# Altium schematic sheet Valve_transistors.SchDoc
size A; SheetNumber: 5; SheetTotal: 6
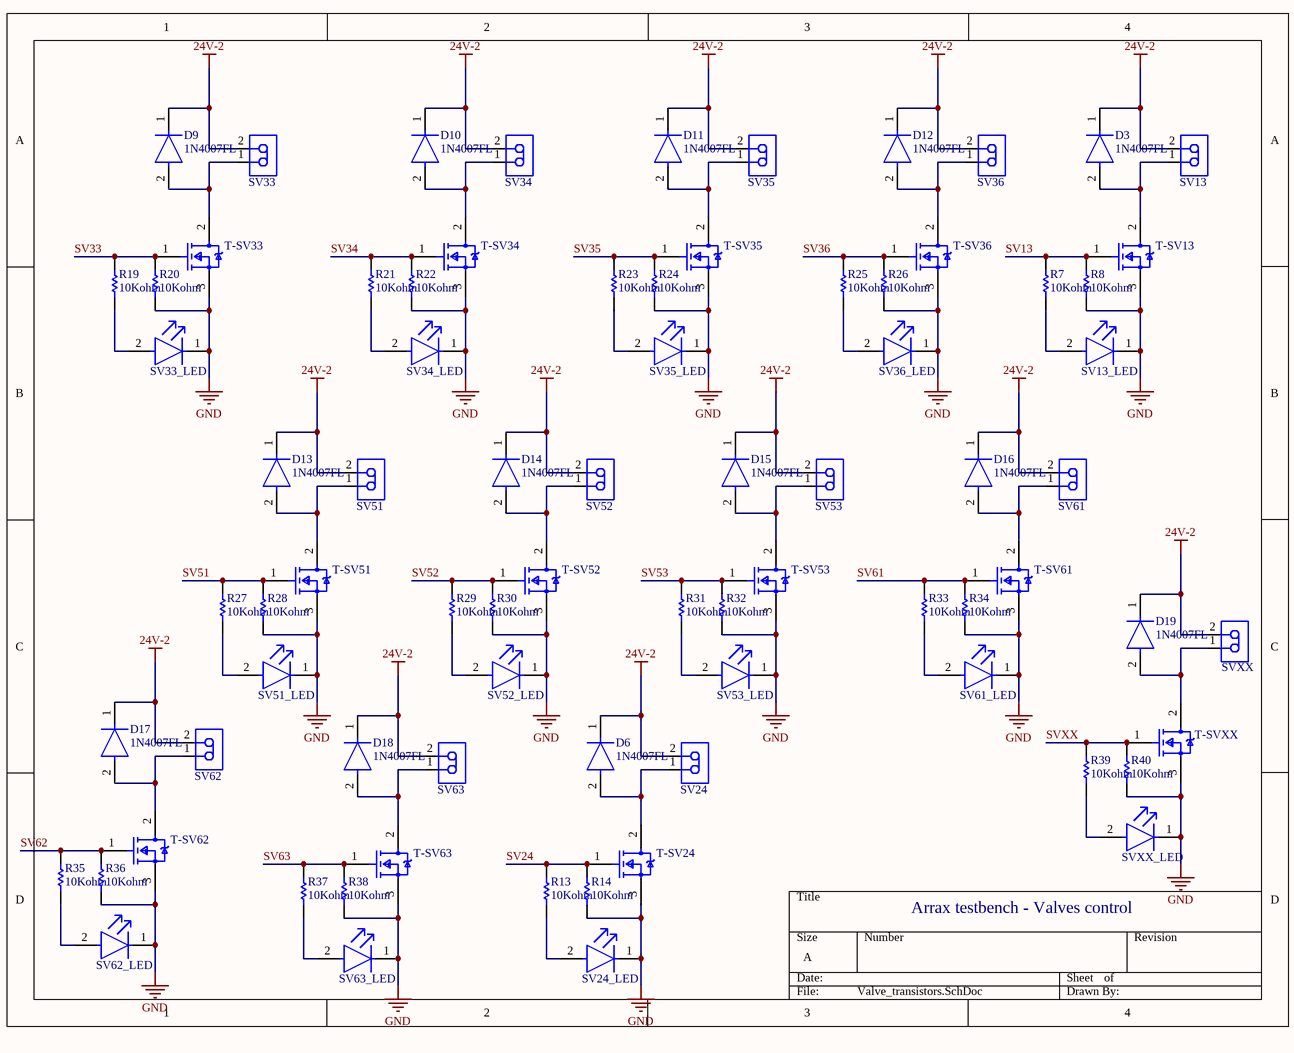
[diagram p0: Valve_transistors.SchDoc]

## Parts
D3  1N4007FL  [FP-1N4007FL-MFG]
D6  1N4007FL  [FP-1N4007FL-MFG]
D9  1N4007FL  [FP-1N4007FL-MFG]
D10  1N4007FL  [FP-1N4007FL-MFG]
D11  1N4007FL  [FP-1N4007FL-MFG]
D12  1N4007FL  [FP-1N4007FL-MFG]
D13  1N4007FL  [FP-1N4007FL-MFG]
D14  1N4007FL  [FP-1N4007FL-MFG]
D15  1N4007FL  [FP-1N4007FL-MFG]
D16  1N4007FL  [FP-1N4007FL-MFG]
D17  1N4007FL  [FP-1N4007FL-MFG]
D18  1N4007FL  [FP-1N4007FL-MFG]
D19  1N4007FL  [FP-1N4007FL-MFG]
R7  10Kohm  [RESC2013X60X30NL20T20]
R8  10Kohm  [RESC2013X60X30NL20T20]
R13  10Kohm  [RESC2013X60X30NL20T20]
R14  10Kohm  [RESC2013X60X30NL20T20]
R19  10Kohm  [RESC2013X60X30NL20T20]
R20  10Kohm  [RESC2013X60X30NL20T20]
R21  10Kohm  [RESC2013X60X30NL20T20]
R22  10Kohm  [RESC2013X60X30NL20T20]
R23  10Kohm  [RESC2013X60X30NL20T20]
R24  10Kohm  [RESC2013X60X30NL20T20]
R25  10Kohm  [RESC2013X60X30NL20T20]
R26  10Kohm  [RESC2013X60X30NL20T20]
R27  10Kohm  [RESC2013X60X30NL20T20]
R28  10Kohm  [RESC2013X60X30NL20T20]
R29  10Kohm  [RESC2013X60X30NL20T20]
R30  10Kohm  [RESC2013X60X30NL20T20]
R31  10Kohm  [RESC2013X60X30NL20T20]
R32  10Kohm  [RESC2013X60X30NL20T20]
R33  10Kohm  [RESC2013X60X30NL20T20]
R34  10Kohm  [RESC2013X60X30NL20T20]
R35  10Kohm  [RESC2013X60X30NL20T20]
R36  10Kohm  [RESC2013X60X30NL20T20]
R37  10Kohm  [RESC2013X60X30NL20T20]
R38  10Kohm  [RESC2013X60X30NL20T20]
R39  10Kohm  [RESC2013X60X30NL20T20]
R40  10Kohm  [RESC2013X60X30NL20T20]
SV13  640456-2  [TECO-640456-2_V]  (value not drawn)
SV13_LED  LS R976-NR-1  [FP-LS_R976-MFG]  (value not drawn)
SV24  640456-2  [TECO-640456-2_V]  (value not drawn)
SV24_LED  LS R976-NR-1  [FP-LS_R976-MFG]  (value not drawn)
SV33  640456-2  [TECO-640456-2_V]  (value not drawn)
SV33_LED  LS R976-NR-1  [FP-LS_R976-MFG]  (value not drawn)
SV34  640456-2  [TECO-640456-2_V]  (value not drawn)
SV34_LED  LS R976-NR-1  [FP-LS_R976-MFG]  (value not drawn)
SV35  640456-2  [TECO-640456-2_V]  (value not drawn)
SV35_LED  LS R976-NR-1  [FP-LS_R976-MFG]  (value not drawn)
SV36  640456-2  [TECO-640456-2_V]  (value not drawn)
SV36_LED  LS R976-NR-1  [FP-LS_R976-MFG]  (value not drawn)
SV51  640456-2  [TECO-640456-2_V]  (value not drawn)
SV51_LED  LS R976-NR-1  [FP-LS_R976-MFG]  (value not drawn)
SV52  640456-2  [TECO-640456-2_V]  (value not drawn)
SV52_LED  LS R976-NR-1  [FP-LS_R976-MFG]  (value not drawn)
SV53  640456-2  [TECO-640456-2_V]  (value not drawn)
SV53_LED  LS R976-NR-1  [FP-LS_R976-MFG]  (value not drawn)
SV61  640456-2  [TECO-640456-2_V]  (value not drawn)
SV61_LED  LS R976-NR-1  [FP-LS_R976-MFG]  (value not drawn)
SV62  640456-2  [TECO-640456-2_V]  (value not drawn)
SV62_LED  LS R976-NR-1  [FP-LS_R976-MFG]  (value not drawn)
SV63  640456-2  [TECO-640456-2_V]  (value not drawn)
SV63_LED  LS R976-NR-1  [FP-LS_R976-MFG]  (value not drawn)
SVXX  640456-2  [TECO-640456-2_V]  (value not drawn)
SVXX_LED  LS R976-NR-1  [FP-LS_R976-MFG]  (value not drawn)
T-SV13  IRLZ44NPbF  [FP-PG-TO220-3-MFG]  (value not drawn)
T-SV24  IRLZ44NPbF  [FP-PG-TO220-3-MFG]  (value not drawn)
T-SV33  IRLZ44NPbF  [FP-PG-TO220-3-MFG]  (value not drawn)
T-SV34  IRLZ44NPbF  [FP-PG-TO220-3-MFG]  (value not drawn)
T-SV35  IRLZ44NPbF  [FP-PG-TO220-3-MFG]  (value not drawn)
T-SV36  IRLZ44NPbF  [FP-PG-TO220-3-MFG]  (value not drawn)
T-SV51  IRLZ44NPbF  [FP-PG-TO220-3-MFG]  (value not drawn)
T-SV52  IRLZ44NPbF  [FP-PG-TO220-3-MFG]  (value not drawn)
T-SV53  IRLZ44NPbF  [FP-PG-TO220-3-MFG]  (value not drawn)
T-SV61  IRLZ44NPbF  [FP-PG-TO220-3-MFG]  (value not drawn)
T-SV62  IRLZ44NPbF  [FP-PG-TO220-3-MFG]  (value not drawn)
T-SV63  IRLZ44NPbF  [FP-PG-TO220-3-MFG]  (value not drawn)
T-SVXX  IRLZ44NPbF  [FP-PG-TO220-3-MFG]  (value not drawn)

## Nets
24V-2: D3.1(C) D6.1(C) D9.1(C) D10.1(C) D11.1(C) D12.1(C) D13.1(C) D14.1(C) D15.1(C) D16.1(C) D17.1(C) D18.1(C) D19.1(C) SV13.2 SV24.2 SV33.2 SV34.2 SV35.2 SV36.2 SV51.2 SV52.2 SV53.2 SV61.2 SV62.2 SV63.2 SVXX.2
GND: R8.1 R14.1 R20.1 R22.1 R24.1 R26.1 R28.1 R30.1 R32.1 R34.1 R36.1 R38.1 R40.1 SV13_LED.1(C) SV24_LED.1(C) SV33_LED.1(C) SV34_LED.1(C) SV35_LED.1(C) SV36_LED.1(C) SV51_LED.1(C) SV52_LED.1(C) SV53_LED.1(C) SV61_LED.1(C) SV62_LED.1(C) SV63_LED.1(C) SVXX_LED.1(C) T-SV13.3(S) T-SV24.3(S) T-SV33.3(S) T-SV34.3(S) T-SV35.3(S) T-SV36.3(S) T-SV51.3(S) T-SV52.3(S) T-SV53.3(S) T-SV61.3(S) T-SV62.3(S) T-SV63.3(S) T-SVXX.3(S)
SV13: R7.2 R8.2 T-SV13.1(G)
SV24: R13.2 R14.2 T-SV24.1(G)
SV33: R19.2 R20.2 T-SV33.1(G)
SV34: R21.2 R22.2 T-SV34.1(G)
SV35: R23.2 R24.2 T-SV35.1(G)
SV36: R25.2 R26.2 T-SV36.1(G)
SV51: R27.2 R28.2 T-SV51.1(G)
SV52: R29.2 R30.2 T-SV52.1(G)
SV53: R31.2 R32.2 T-SV53.1(G)
SV61: R33.2 R34.2 T-SV61.1(G)
SV62: R35.2 R36.2 T-SV62.1(G)
SV63: R37.2 R38.2 T-SV63.1(G)
SVXX: R39.2 R40.2 T-SVXX.1(G)
NetD3_2: D3.2(A) SV13.1 T-SV13.2(D)
NetD6_2: D6.2(A) SV24.1 T-SV24.2(D)
NetD9_2: D9.2(A) SV33.1 T-SV33.2(D)
NetD10_2: D10.2(A) SV34.1 T-SV34.2(D)
NetD11_2: D11.2(A) SV35.1 T-SV35.2(D)
NetD12_2: D12.2(A) SV36.1 T-SV36.2(D)
NetD13_2: D13.2(A) SV51.1 T-SV51.2(D)
NetD14_2: D14.2(A) SV52.1 T-SV52.2(D)
NetD15_2: D15.2(A) SV53.1 T-SV53.2(D)
NetD16_2: D16.2(A) SV61.1 T-SV61.2(D)
NetD17_2: D17.2(A) SV62.1 T-SV62.2(D)
NetD18_2: D18.2(A) SV63.1 T-SV63.2(D)
NetD19_2: D19.2(A) SVXX.1 T-SVXX.2(D)
NetR7_1: R7.1 SV13_LED.2(A)
NetR13_1: R13.1 SV24_LED.2(A)
NetR19_1: R19.1 SV33_LED.2(A)
NetR21_1: R21.1 SV34_LED.2(A)
NetR23_1: R23.1 SV35_LED.2(A)
NetR25_1: R25.1 SV36_LED.2(A)
NetR27_1: R27.1 SV51_LED.2(A)
NetR29_1: R29.1 SV52_LED.2(A)
NetR31_1: R31.1 SV53_LED.2(A)
NetR33_1: R33.1 SV61_LED.2(A)
NetR35_1: R35.1 SV62_LED.2(A)
NetR37_1: R37.1 SV63_LED.2(A)
NetR39_1: R39.1 SVXX_LED.2(A)

## Notes on the sheet
- Arrax testbench - Valves control

## Library data of the parts
D3 D6 D9-D19 = CMP-10078-122641204-1: 1N4007FL Diode Gen Purp 1KV 1A SOD123FL; Capacitance: 6pF; Max Junction Temperature (Tj): 150°C; Peak Reverse Current: 5µA; Max Forward Surge Current (Ifsm): 30A; Reverse Voltage: 1kV; Max Operating Temperature: 150°C; Height: 1.1mm; Min Operating Temperature: -55°C; Forward Current: 1A; Max Repetitive Reverse Voltage (Vrrm): 1kV; NexarPartId: 122641204
R7 R8 R13 R14 R19-R40 = CMP-2001-01994-1: Manufacturer: KOA Speer; Part Number: RK73H2ATTD1003F
SV13 SV24 SV33-SV36 SV51-SV53 SV61-SV63 SVXX = CMP-2000-05417-1: Male Header, Pitch 2.54 mm, 1 x 2 Position, Height 10.49 mm, Tail Length 3.556 mm, -55 to 105 degC, RoHS, Bulk; Manufacturer: TE Connectivity; Standards: RoHSCompliant,ELVCompliant,UL94V-0; Material, Housing: Polyester; Agency Approvals: CSA,UL; Brand/Series: MTA-100Series; Contact Centerline Spacing: 0.100 / in.; Material, Contact: CopperAlloy; Current, Rating: 5 / A; Color, Housing: White; Contact Termination Area Plating: Tin; Special Features: Pinstrip; Number of Positions: 2; Pin Spacing: 0.1 / "; Temperature, Operating: -55to+105 / degC; Angle: Straight; Mount Angle: Vertical; Connector Type: MTA-100; Primary Type: InterconnectSystem; Voltage, Rating: 250 / V; Mounting Hole Size: 0.04 / "; Number of Rows: 1; Termination: Solder; Length, Terminal Post: 0.14 / in.; Manufacturer URL: http://www.te.com/; Color: White; Size, Post: 0.025 / in.; Contact Shape: Square; Mounting Type: PCMount; Datasheet URL: https://datasheet.ciiva.com/11746/0900766b80eb7fdd-11746365.pdf; Type: PCBPlug; Datasheet Version: Rev. W, 06/2004; Number of Contacts: 2; Flammability Rating: UL94V-0; Contact Plating: Tin; Length, Pin: 0.14 / "; Contact Mating Area Plating: Tin; Length, Overall: 0.2 / "
SV13_LED SV24_LED SV33_LED SV34_LED SV35_LED SV36_LED SV51_LED SV52_LED SV53_LED SV61_LED SV62_LED SV63_LED SVXX_LED = CMP-62016-000037-1: LED RED DIFFUSED 0805 SMD; Lens Size: 1.25mm; Number of LEDs: 1; Luminous Intensity: 180mcd; Dominant Wavelength: 633nm; Lens Style: Flat; Reverse Voltage: 12V; Lens Color: White; Forward Voltage: 2.5V; Forward Current: 25mA; Power Dissipation: 65W; Luminous Flux: 0.47lm; Test Current: 20mA; Viewing Angle: 160°; Length: 2mm; Number of Pins: 2; Lens Transparency: Diffused; Min Operating Temperature: -30°C; Case Code (Metric): 2012; Depth: 1.35mm; Color: Red; Illumination Color: Red; Max Operating Temperature: 85°C; Mount: Surface Mount; Case/Package: 0805; Height: 0.9mm; Package Quantity: 16000; Number of Elements: 1; Radiation Hardening: No; Case Code (Imperial): 0805; Packaging: Tape and Reel; Width: 1.25mm
T-SV13 T-SV24 T-SV33-T-SV36 T-SV51-T-SV53 T-SV61-T-SV63 T-SVXX = CMP-32901-000488-1: MOSFET N-CH 55V 47A TO220AB; Turn-On Delay Time: 11ns; Gate to Source Voltage (Vgs): 16V; Element Configuration: Single; Rds On Max: 22mR; Turn-Off Delay Time: 26ns; Max Power Dissipation: 110W; Threshold Voltage: 2V; Drain to Source Resistance: 35mR; Input Capacitance: 1.7nF; Continuous Drain Current (ID): 47A; Case/Package: TO-220; Lead Free: Lead Free; Halogen Free: Halogen Free; Packaging: Rail/Tube; Length: 0.414inch; Min Operating Temperature: -55°C; REACH SVHC: No SVHC; Number of Pins: 3; Width: 0.185inch; Drain to Source Voltage (Vdss): 55V; Power Dissipation: 110W; RoHS Compliant: Yes; Max Operating Temperature: 175°C; Height: 0.6inch; Max Dual Supply Voltage: 55V; Drain to Source Breakdown Voltage: 55V; Mount: Through Hole